# EasyEDA Pro project ProDoc_Mouth Board_2025-04-16.epro

# Schematic Mouth Board
Board Name: Mouth Board; Create Date: 2025-03-15; Page Name: P1; Project Name: Robotic Head α2; Schematic Name: Mouth Board; Update Date: 2025-03-17; Company: EasyEDA.com; Page Size: A4; Version: V1.0
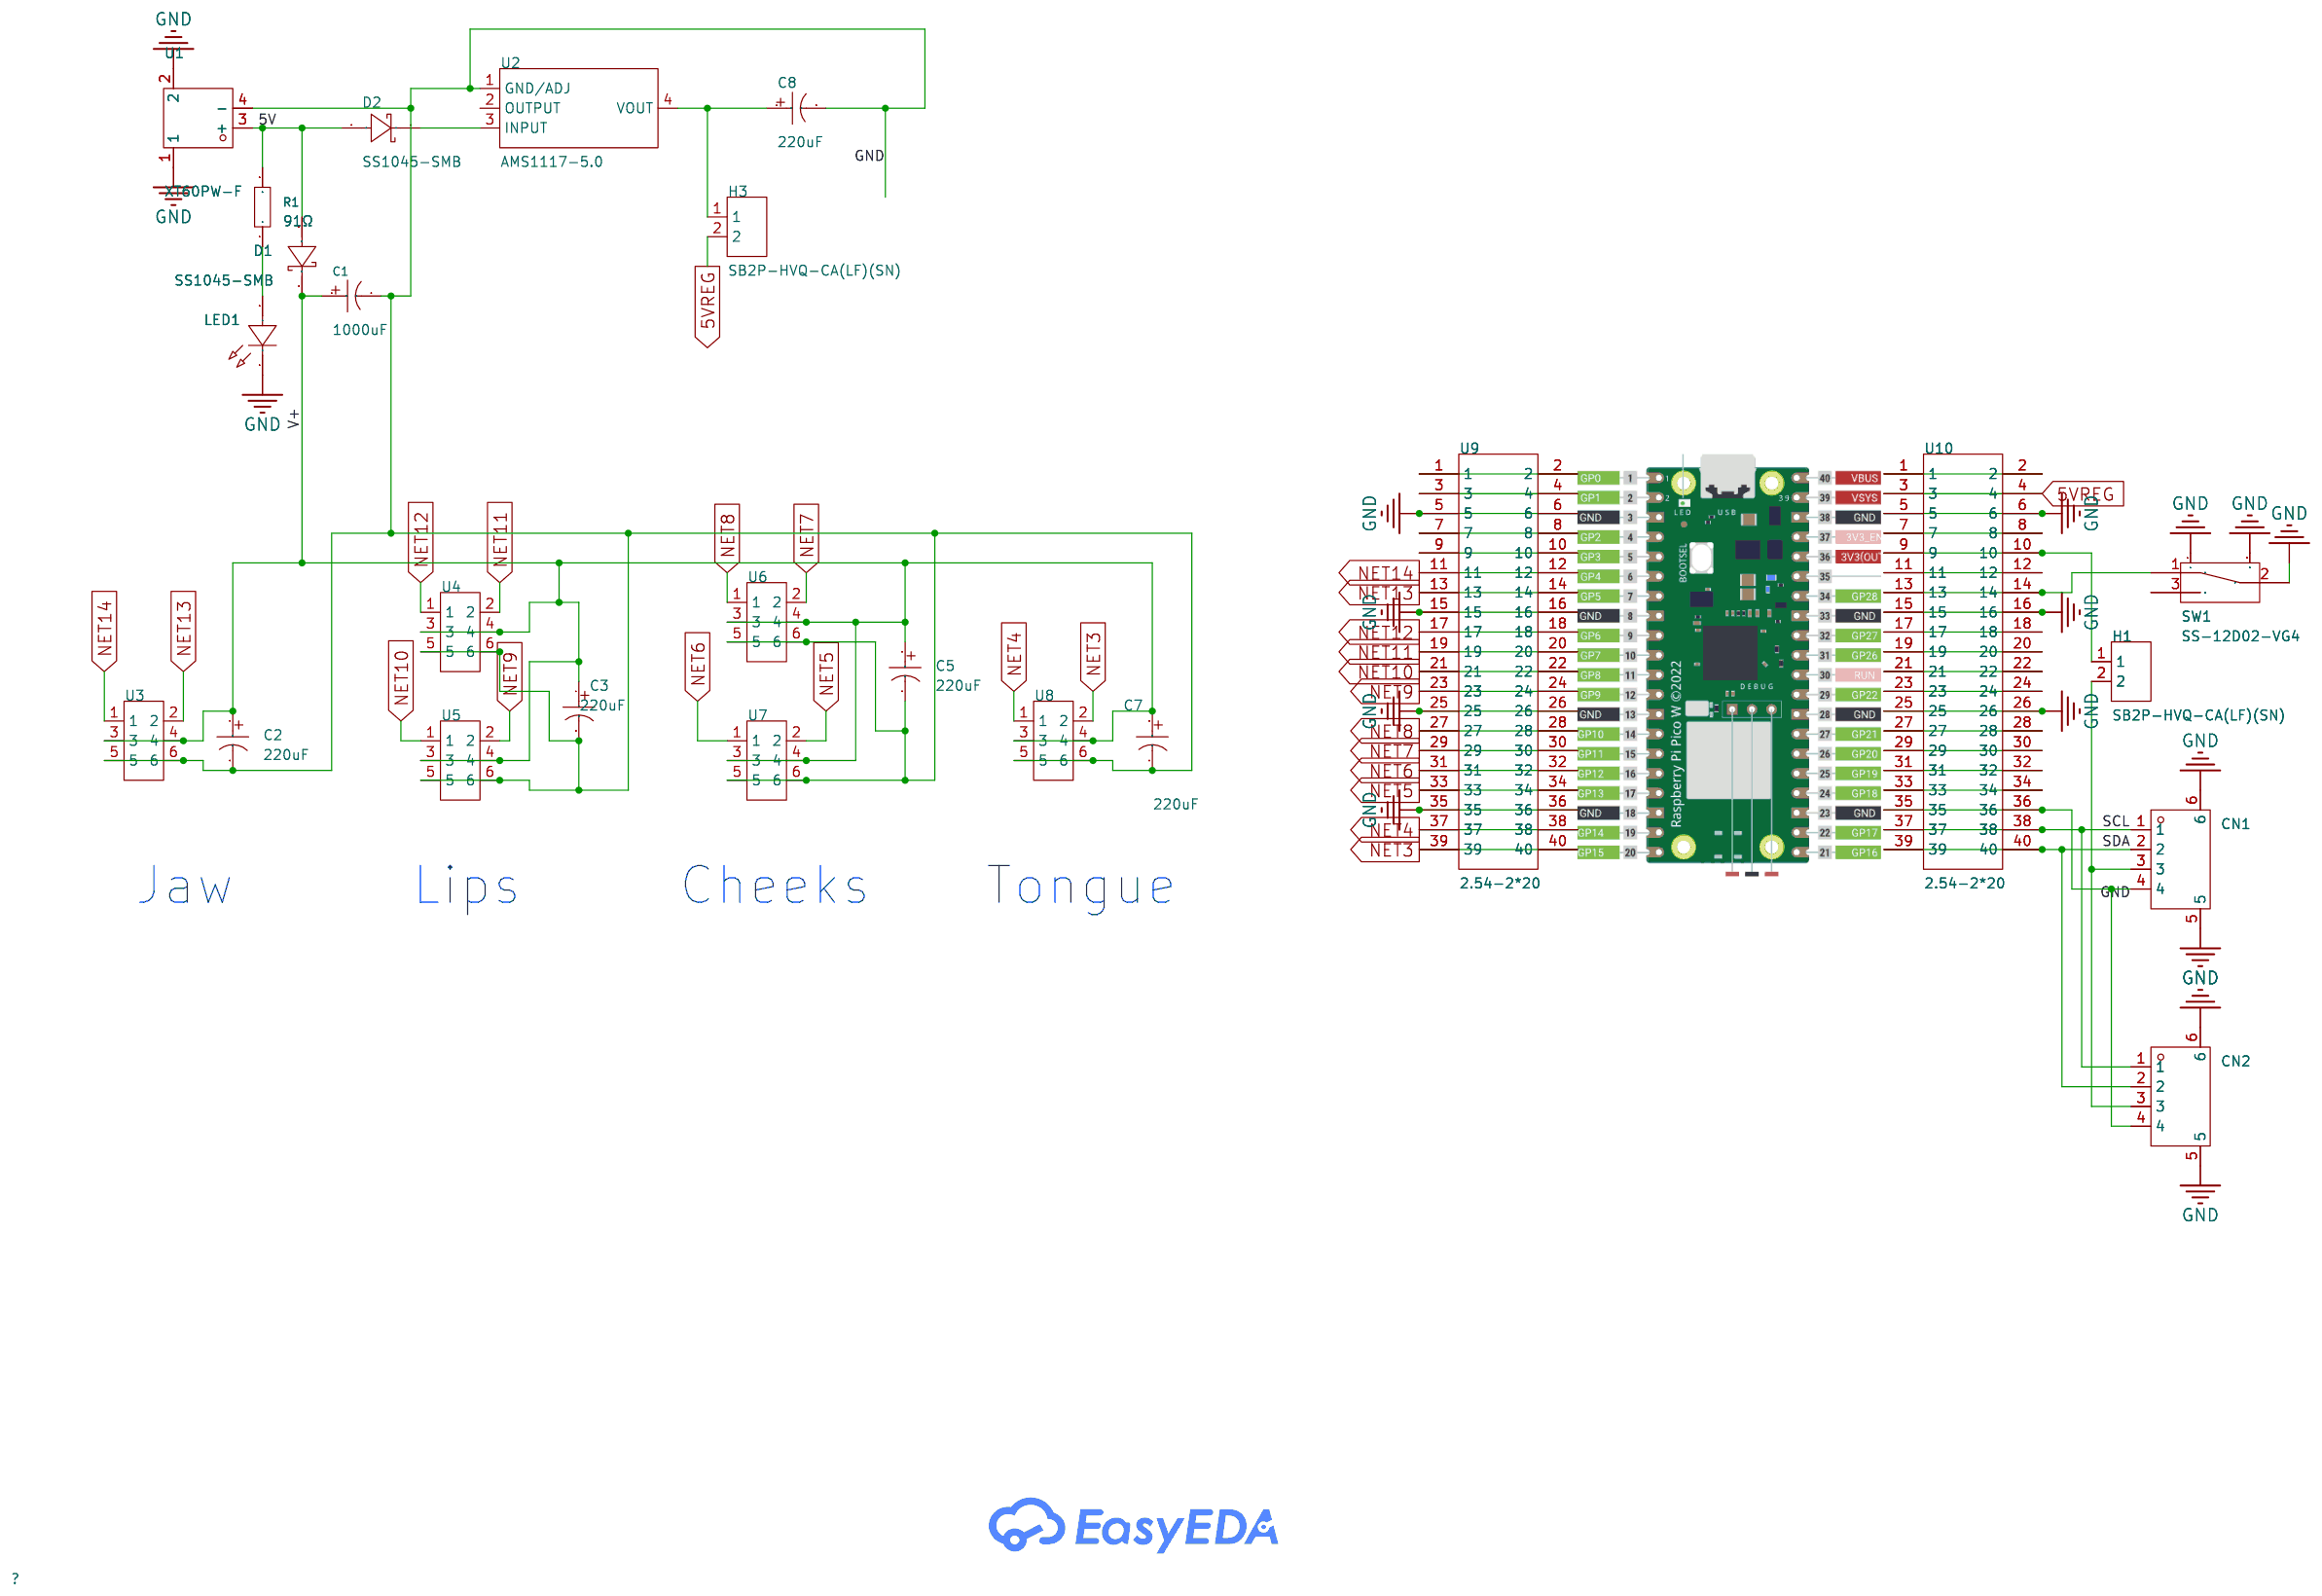
[diagram p0: schematic sheet]

## Parts
C1  1000uF  [CAP-SMD_BD10.0-L10.3-W10.3-FD]
C2  220uF  [CAP-SMD_BD6.3-L6.6-W6.6-FD]
C3  220uF  [CAP-SMD_BD6.3-L6.6-W6.6-FD]
C5  220uF  [CAP-SMD_BD6.3-L6.6-W6.6-FD]
C7  220uF  [CAP-SMD_BD6.3-L6.6-W6.6-FD]
C8  220uF  [CAP-SMD_BD6.3-L6.6-W6.6-FD]
CN1  HC-1.0-4PWT  [CONN-SMD_4P-P1.00_HCTL_HC-1.0-4PWT]
CN2  HC-1.0-4PWT  [CONN-SMD_4P-P1.00_HCTL_HC-1.0-4PWT]
D1  SS1045-SMB  [SMB_L4.4-W3.6-LS5.3-RD]
D2  SS1045-SMB  [SMB_L4.4-W3.6-LS5.3-RD]
H1  SB2P-HVQ-CA(LF)(SN)  [HDR-TH_2P-P2.54-V-M-1]
H3  SB2P-HVQ-CA(LF)(SN)  [HDR-TH_2P-P2.54-V-M-1]
LED1  XL-1608UBC-04  [LED0603-RD_BLUE]
R1  91Ω  [R1206]
SW1  SS-12D02-VG4  [SW-TH_SS-12D02-VG4]
U1  XT60PW-F  [TH_2P-XT60PW-F]
U2  AMS1117-5.0  [SOT-223-3_L6.5-W3.4-P2.30-LS7.0-BR]
U3  ZX-PZ2.54-2-3PZZ  [HDR-TH_6P-P2.54-V-M-R2-C3-S2.54-1]
U4  ZX-PZ2.54-2-3PZZ  [HDR-TH_6P-P2.54-V-M-R2-C3-S2.54-1]
U5  ZX-PZ2.54-2-3PZZ  [HDR-TH_6P-P2.54-V-M-R2-C3-S2.54-1]
U6  ZX-PZ2.54-2-3PZZ  [HDR-TH_6P-P2.54-V-M-R2-C3-S2.54-1]
U7  ZX-PZ2.54-2-3PZZ  [HDR-TH_6P-P2.54-V-M-R2-C3-S2.54-1]
U8  ZX-PZ2.54-2-3PZZ  [HDR-TH_6P-P2.54-V-M-R2-C3-S2.54-1]
U9  2.54-2*20  [HDR-TH_40P-P2.54-V-F-R2-C20-S2.54]
U10  2.54-2*20  [HDR-TH_40P-P2.54-V-F-R2-C20-S2.54]

## Library data of the parts
C1 = RVT1C102M1010: Capacitance: Tolerance:±20% Tolerance:±20% Rated Voltage: Ripple Current:- Equivalent Series Resistance(ESR):- φD: L: Lifetime @ Temp:2000hrs@105℃ Operating Temperature:-55℃~+105℃ Operating Temperature:-55℃~+105℃; LCSC Part Name: 1000uF ±20% 16V; Supplier Part: C3359; Manufacturer: HONOR(荣誉); Supplier Footprint: SMD,D10xL10.2mm; JLCPCB Part Class: Extended Part; Datasheet: https://atta.szlcsc.com/upload/public/pdf/source/20210521/C113284_25C86AE95FB541053FE695F13EA8E7D0.pdf; Supplier: LCSC; Tolerance: ±20%; Lifetime @ Temp: 2000hrs@105℃; Operating Temperature: -55℃~+105℃
C2 C3 C5 C7 C8 = RVT1A221M0605_C72494: Capacitance: Tolerance:±20% Tolerance:±20% Voltage Rating: Ripple Current: Equivalent Series Resistance(ESR):- Diameter: Height - Seated (Max): Lifetime:2000hrs@105℃ Operating Temperature:-40℃~+105℃ Operating Temperature:-40℃~+105℃; LCSC Part Name: 220uF ±20% 10V; Supplier Part: C72494; Manufacturer: ROQANG(容强); Manufacturer Part: RVT1A221M0605; Supplier Footprint: SMD,D6.3xL5.4mm; JLCPCB Part Class: Extended Part; Datasheet: https://atta.szlcsc.com/upload/public/pdf/source/20170325/1490427950282.pdf; Supplier: LCSC; Tolerance: ±20%; Lifetime: 2000hrs@105℃; Operating Temperature: -40℃~+105℃
CN1 CN2 = HC-1.0-4PWT: Pins Structure:1x4P Pitch:1mm Mounting Style:Horizontal attachment Reference Series:SH Number of Pins:4P Number of Rows:1 Number of PINs Per Row:4 Row Spacing:- Current Rating (Max):1A Contact Material:Phosphor Bronze Contact Plating:Tin Operating Tempera; LCSC Part Name: 1x4P 间距:1mm 卧贴 系列:SH; Supplier Part: C2845363; Manufacturer: HCTL(华灿天禄); Supplier Footprint: SMD,P=1mm,卧贴; JLCPCB Part Class: Extended Part; Datasheet: https://atta.szlcsc.com/upload/public/pdf/source/20230707/696F47DD5B3D5495B4AB8BCE302E8A84.pdf; Supplier: LCSC; Pins Structure: 1x4P; Pitch: 1mm; Mounting Style: Horizontal attachment; Reference Series: SH; Number of Pins: 4P; Number of Rows: 1; Number of PINs Per Row: 4; Current Rating (Max): 1A; Contact Material: Phosphor Bronze; Contact Plating: Tin; Operating Temperature Range: -25℃~+85℃; Rated Voltage (Max): 50V; Plastic Material: LCP; Flame Retardant Rating: UL94V-0; Supplementary Features: Auxiliary soldering legs; Z-Height of the Board: 3.2mm; X-Length of Bottom Edge on Board (Spacing Line): 6.3mm; Y-Width of Bottom Edge on Board: 5.05mm
D1 D2 = SS1045-SMB: Diode Configuration:Independent Type Voltage - Forward(Vf@If):550mV@10A Voltage - DC Reverse(Vr):45V Current - Rectified:10A Reverse Leakage Current (Ir):100nA; LCSC Part Name: 电压:45V 电流:10A; Supplier Part: C2903947; Manufacturer: GOODWORK(固得沃克); Supplier Footprint: SMB(DO-214AA); JLCPCB Part Class: Extended Part; Datasheet: https://atta.szlcsc.com/upload/public/pdf/source/20240617/4C132C80E36BDBE9AB2C039856844535.pdf; Supplier: LCSC; Diode Configuration: Independent Type; Voltage - Forward(Vf@If): 550mV@10A; Voltage - DC Reverse(Vr): 45V; Current - Rectified: 10A; Reverse Leakage Current (Ir): 100nA
H1 H3 = SB2P-HVQ-CA(LF)(SN): Pin Structure:1x2P Pitch:2.5mm Row Spacing:- Circluar Pins/Square Pins:- Mounting Type:Straight Number of Rows:Single Row Number of Pins:2P Current Rating:- Voltage Rating (Max):- Length of Mating Pin:7.5mm Insulation Height:3.3mm Length of End Connection; LCSC Part Name: 1x2P 间距:2.5mm 直插; Supplier Part: C157909; Manufacturer: JST; Supplier Footprint: 插件,P=2.5mm; JLCPCB Part Class: Extended Part; Datasheet: https://atta.szlcsc.com/upload/public/pdf/source/20180319/2518302FDF705D922213CC841EAA9FB0.pdf; Supplier: LCSC; Pin Structure: 1x2P; Pitch: 2.5mm; Mounting Type: Straight; Number of Rows: Single Row; Number of Pins: 2P; Length of Mating Pin: 7.5mm; Insulation Height: 3.3mm; Length of End Connection Pin: 3.4mm; Contact Material: Brass; Operating Temperature: -25℃~+85℃; Color: White
LED1 = XL-1608UBC-04: Lamp Holder Type:- Illumination Color:Blue Voltage - Forward(Vf):3.3V Voltage - Forward(Vf):3.3V Power(Watts):70mW Forward Current:20mA Wavelength - Dominant:455nm~475nm Wavelength - Dominant:455nm~475nm Peak Wavelength:470nm Diode Configuration:- Lens Co; Supplier Part: C965807; Manufacturer: XINGLIGHT(成兴光); Supplier Footprint: 0603; JLCPCB Part Class: Extended Part; Datasheet: https://atta.szlcsc.com/upload/public/pdf/source/20250213/9D28F40E58C3285D8CA3C7212E2FBA3B.pdf; Supplier: LCSC; Illumination Color: Blue; Voltage - Forward(Vf): 3.3V; Power(Watts): 70mW; Forward Current: 20mA; Wavelength - Dominant: 455nm~475nm; Peak Wavelength: 470nm; Lens Color: Colorless Transparent Lens; Luminous Intensity: 300mcd; Viewing Angle: 120°; Mounting Sytle: Positive Stick; Operating Temperature: -20℃~+85℃
R1 = 1206W4F910JT5E: Type:Thick Film Resistors Resistance:91Ω Tolerance:±1% Tolerance:±1% Power(Watts): Overload Voltage (Max): Temperature Coefficient:±100ppm/℃ Temperature Coefficient:±100ppm/℃ Operating Temperature Range:-55℃~+155℃ Operating Temperature Range:-55℃~+155℃; LCSC Part Name: 91Ω ±1% 250mW 厚膜电阻; Supplier Part: C25346; Manufacturer: UNI-ROYAL(厚声); Supplier Footprint: 1206; JLCPCB Part Class: Extended Part; Datasheet: https://atta.szlcsc.com/upload/public/pdf/source/20200306/C422600_1E6D84923E4A46A82E41ADD87F860B5C.pdf; Supplier: LCSC; Type: Thick Film Resistors; Tolerance: ±1%; Temperature Coefficient: ±100ppm/℃; Operating Temperature Range: -55℃~+155℃
SW1 = SS-12D02-VG4_C136719: Circuit:SPDT Actuator Style:Rectangular columnar Pin Style:PCPin Switch Height:8.7mm Mounting Style:Straight Current Rating (DC):- Voltage Rating (DC):- Current Rating (AC):- Voltage Rating (AC):- Mechanical Life:5千次 Operating Temperature:-25℃~+70℃ Operat; LCSC Part Name: 直插双档 滑动开关; Supplier Part: C136719; Manufacturer: 韩国韩荣; Supplier Footprint: 插件; JLCPCB Part Class: Extended Part; Datasheet: https://atta.szlcsc.com/upload/public/pdf/source/20171030/C136719_15093664985151068208.pdf; Supplier: LCSC; Circuit: SPDT; Actuator Style: Rectangular columnar; Pin Style: PCPin; Switch Height: 8.7mm; Mounting Style: Straight; Mechanical Life: 5千次; Operating Temperature: -25℃~+70℃
U1 = XT60PW-F: Power:- Output:- Input:- Size:- Interface:- Type:- Colour:Yellow MaximumCurrent:- Type:卧式插头 RatedVoltage:- Type1:- NumberOfUSBHoles:- InterfaceType:母头 MetalMaterial:- InsulationMaterial:- RatedCurrent:- RecommendedWireGauge:- FlameRetardantGrade:- contact; LCSC Part Name: AMASS(艾迈斯)插头连接器锂电池组充电接口 航模电调卧式焊板 母头 XT60PW-F; Supplier Part: C428722; Manufacturer: AMASS(艾迈斯); JLCPCB Part Class: Extended Part; Datasheet: https://atta.szlcsc.com/upload/public/pdf/source/20190916/C428722_DFF78979486FCB0B58C1FC563067EC88.pdf; Supplier: LCSC; Type: 卧式插头; Colour: Yellow; InterfaceType: 母头
U2 = AMS1117-5.0_C18212701: Output Type:Fixed Voltage - Supply:18V Output Voltage:5V Output Voltage:5V Output Current:1A Power Supply Rejection Ratio (PSRR):- Voltage Dropout:- standby current:- Noise:- Features:- Operating Temperature:- Operating Temperature:- Output Configuration:; Supplier Part: C18212701; Manufacturer: TECH PUBLIC(台舟); Supplier Footprint: SOT-223; JLCPCB Part Class: Extended Part; Datasheet: https://atta.szlcsc.com/upload/public/pdf/source/20231020/00568B8DF9DEE7CA65DA1D1C34EC001F.pdf; Supplier: LCSC; Output Type: Fixed; Voltage - Supply: 18V; Output Voltage: 5V; Output Current: 1A
U3-U8 = ZX-PZ2.54-2-3PZZ: Pin Structure:2x3P Pitch:2.54mm Row Spacing:2.54mm Circluar Pins/Square Pins:Policy Mounting Type:Straight Number of Rows:Double Row Number of Pins:6P Current Rating:3A Voltage Rating (Max):1kV Length of Mating Pin:6mm Insulation Height:2.5mm Length of En; LCSC Part Name: 2x3P 间距:2.54mm 方针 直插; Supplier Part: C7501274; Manufacturer: Megastar(兆星); Supplier Footprint: 插件,P=2.54mm; JLCPCB Part Class: Extended Part; Datasheet: https://atta.szlcsc.com/upload/public/pdf/source/20231122/E8390501A702A71E626C593F036B3607.pdf; Supplier: LCSC; Pin Structure: 2x3P; Pitch: 2.54mm; Row Spacing: 2.54mm; Circluar Pins/Square Pins: Policy; Mounting Type: Straight; Number of Rows: Double Row; Number of Pins: 6P; Current Rating: 3A; Voltage Rating (Max): 1kV; Length of Mating Pin: 6mm; Insulation Height: 2.5mm; Length of End Connection Pin: 3mm; Contact Material: Brass; Contact Plating: Gold; Operating Temperature: -40℃~+105℃; Color: Black
U9 U10 = 2.54-2*20: Holes Structure:2x20P Pitch:2.54mm Row Spacing:2.54mm Circular Hole / Square Hole:Square Holes Mounting Type:Straight Number of Rows:双排 Number of Holes:40P Current Rating (Max):2.5A Voltage Rating (Max):- Holes Direction:Top Insulation Height:8.5mm Operat; LCSC Part Name: 间距:2.54mm 2x20P 直插; Supplier Part: C2977589; Manufacturer: ZHOURI(洲日); Supplier Footprint: 插件,P=2.54mm; JLCPCB Part Class: Extended Part; Datasheet: https://atta.szlcsc.com/upload/public/pdf/source/20220328/834E302BE3C038BBC5C70F5E02589B1E.pdf; Supplier: LCSC; Holes Structure: 2x20P; Pitch: 2.54mm; Row Spacing: 2.54mm; Circular Hole / Square Hole: Square Holes; Mounting Type: Straight; Number of Rows: 双排; Number of Holes: 40P; Current Rating (Max): 2.5A; Holes Direction: Top; Insulation Height: 8.5mm; Operating Temperature Range: -40℃~+105℃

## Nets
5V: D1.2 D2.2 R1.2 U1.3(+)
5VREG: H3.2 U10.3 U10.4
GND: C1.2 C2.2 C3.2 C5.2 C7.2 C8.2 CN1.4 CN1.5 CN1.6 CN2.4 CN2.5 CN2.6 LED1.1(K) SW1.2 SW1.4 SW1.5 U1.1 U1.2 U1.4(-) U2.1(GND/ADJ) U3.5 U3.6 U4.5 U4.6 U5.5 U5.6 U6.5 U6.6 U7.5 U7.6 U8.5 U8.6 U9.5 U9.6 U9.15 U9.16 U9.25 U9.26 U9.35 U9.36 U10.5 U10.6 U10.15 U10.16 U10.25 U10.26 U10.35 U10.36
NET3: U8.2 U9.39 U9.40
NET4: U8.1 U9.37 U9.38
NET5: U7.2 U9.33 U9.34
NET6: U7.1 U9.31 U9.32
NET7: U6.2 U9.29 U9.30
NET8: U6.1 U9.27 U9.28
NET9: U5.2 U9.23 U9.24
NET10: U5.1 U9.21 U9.22
NET11: U4.2 U9.19 U9.20
NET12: U4.1 U9.17 U9.18
NET13: U3.2 U9.13 U9.14
NET14: U3.1 U9.11 U9.12
SCL: CN1.1 CN2.1 U10.37 U10.38
SDA: CN1.2 CN2.2 U10.39 U10.40
V+: C1.1 C2.1 C3.1 C5.1 C7.1 D1.1 U3.3 U3.4 U4.3 U4.4 U5.3 U5.4 U6.3 U6.4 U7.3 U7.4 U8.3 U8.4
$1N4017: D2.1 U2.3(INPUT)
$1N4091: U10.1 U10.2
$1N4100: U10.7 U10.8
$1N4115: U10.11 U10.12
$1N4130: U10.17 U10.18
$1N4135: U10.19 U10.20
$1N4140: U10.21 U10.22
$1N4145: U10.23 U10.24
$1N4155: U10.27 U10.28
$1N4160: U10.29 U10.30
$1N4165: U10.31 U10.32
$1N4170: U10.33 U10.34
$1N4286: U9.9 U9.10
$1N4291: U9.7 U9.8
$1N4323: U9.3 U9.4
$1N4327: U9.1 U9.2
$1N5155: CN1.3 CN2.3 H1.2
$1N5159: H1.1 U10.9 U10.10
$1N6464: SW1.1 U10.13 U10.14
$1N7592: LED1.2(A) R1.1
Net-(C8-1): C8.1 H3.1 U2.4(VOUT)

Not connected (* = marked no-connect by the designer): SW1 3; U2 2(OUTPUT)

## Notes on the sheet
- Jaw
- Lips
- Cheeks
- Tongue

# Board Mouth Board
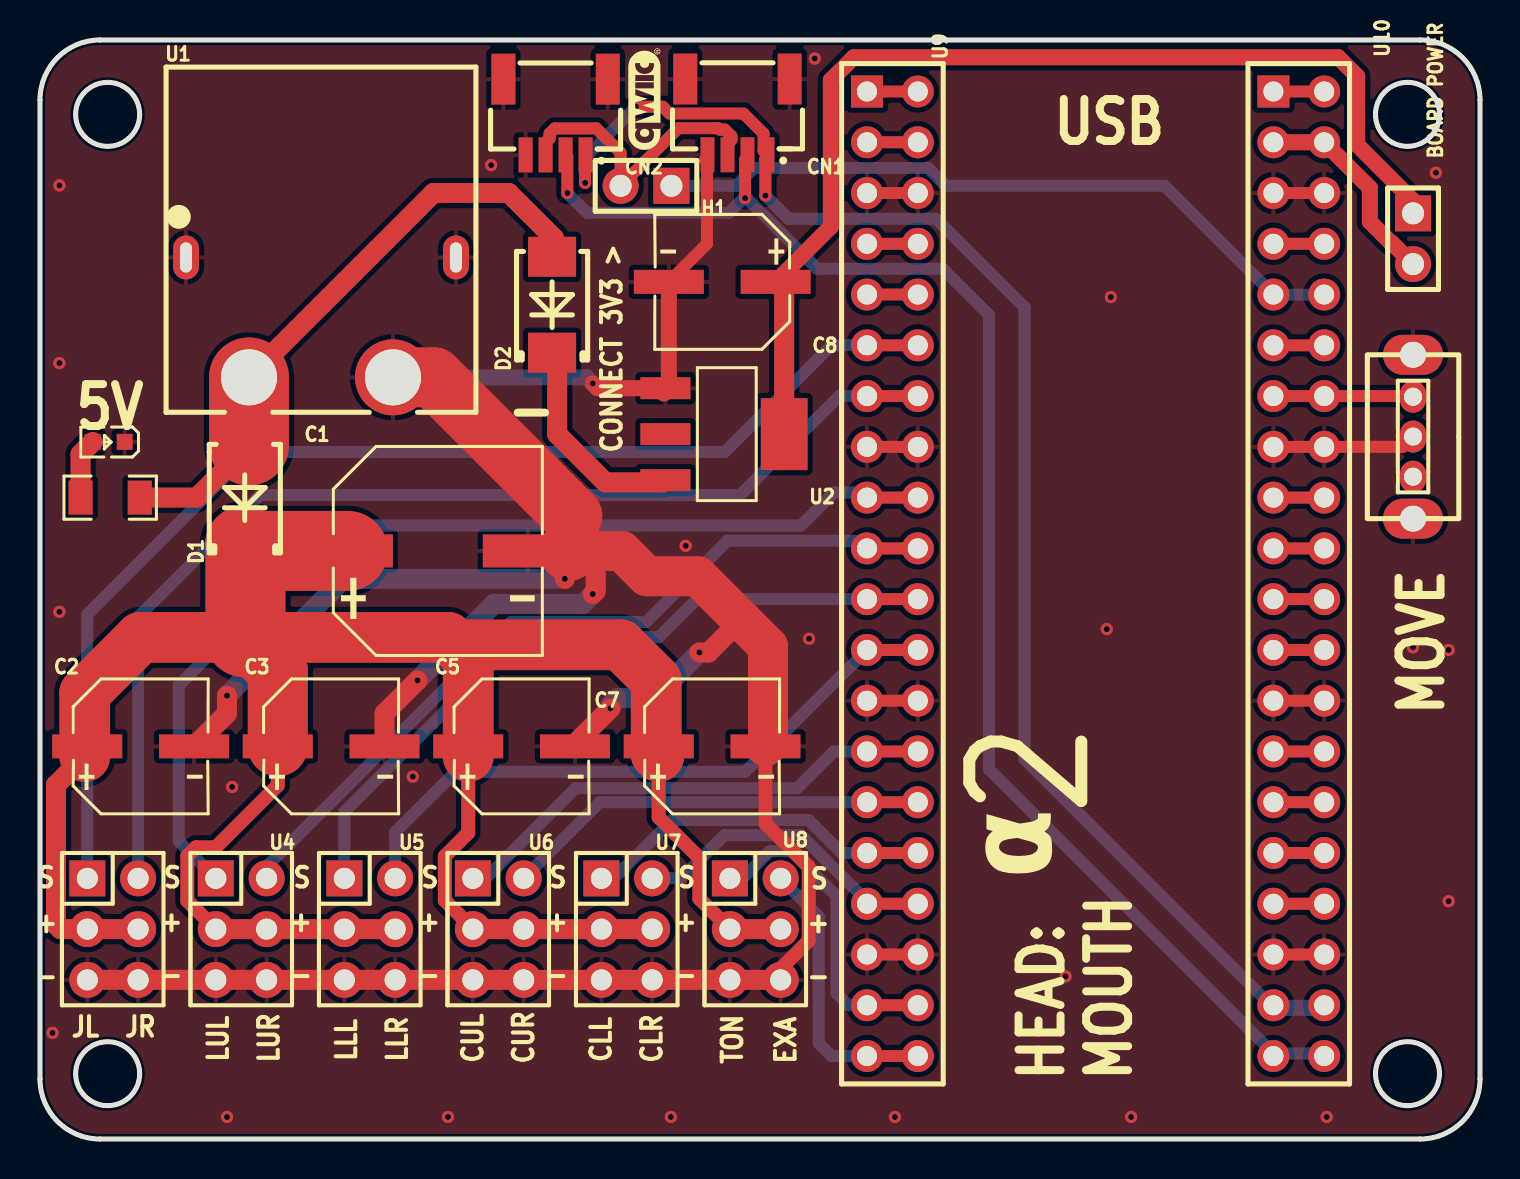
[diagram p1: board, top side]
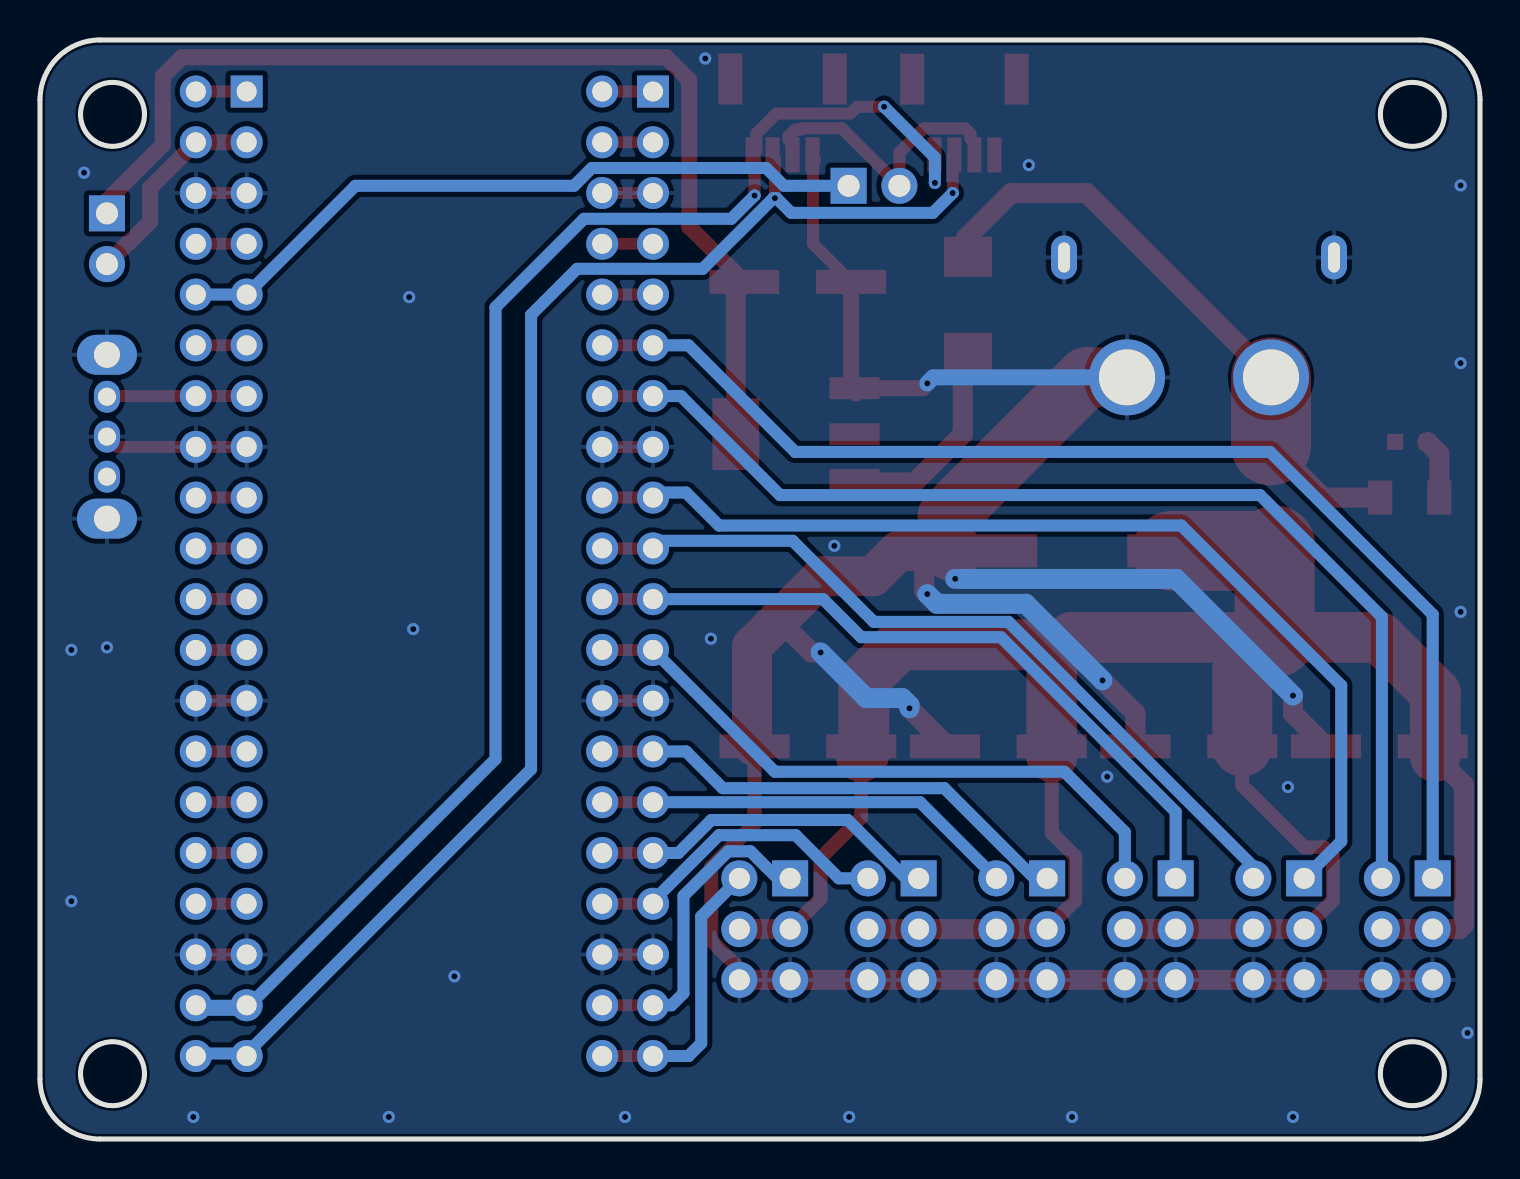
[diagram p2: board, bottom side, seen from below]

Outline 72.01 x 54.99 mm; copper layers: Top Layer, Bottom Layer. Coordinates in mm from the lower left corner of the outline.
Outline path: circle c3.38,51.27 r1.6 ; circle c3.38,3.27 r1.6 ; circle c68.38,51.27 r1.6 ; circle c68.38,3.27 r1.6 ; 0,51.99 0,3 arc(0.88,0.88) 3,0 69.01,0 arc(71.13,0.88) 72.01,3 72.01,51.99 arc(71.13,54.11) 69.01,54.99 3,54.99 arc(0.88,54.11) 0,51.99
Stack: Top Layer 0.035mm / Dielectric1 1.51mm FR4 er 4.5 / Bottom Layer 0.035mm

## Design rules (mm)
template: Custom Config
spacing copperThickness1oz (default): track to track 0.102, other pairs 0.152 to 0.3
spacing copperThickness2oz: track to track 0.203, other pairs 0.152 to 0.3
track width copperThickness1oz (default): min 0.127, default 0.254, max 10
track width copperThickness2oz: min 0.203, default 0.254, max 2.54
differential pair differentialPair (default): width min 0.127, default 0.254, max 2.54; gap min 0.152, default 0.152
via viaSize (default): diameter min 0.5, default 0.61, max 10; hole min 0.3, default 0.305, max 6.3

## Placement (name value [footprint] x y rotation side)
BOARD POWER  SB2P-HVQ-CA(LF)(SN)  [HDR-TH_2P-P2.54-V-M-1]  68.66 45.05 270 top
C1  1000uF  [CAP-SMD_BD10.0-L10.3-W10.3-FD]  19.89 29.43 0 top
C2  220uF  [CAP-SMD_BD6.3-L6.6-W6.6-FD]  5.03 19.65 0 top
C3  220uF  [CAP-SMD_BD6.3-L6.6-W6.6-FD]  14.56 19.65 0 top
C5  220uF  [CAP-SMD_BD6.3-L6.6-W6.6-FD]  24.08 19.65 0 top
C7  220uF  [CAP-SMD_BD6.3-L6.6-W6.6-FD]  33.61 19.65 0 top
C8  220uF  [CAP-SMD_BD6.3-L6.6-W6.6-FD]  34.12 42.89 180 top
CN1  HC-1.0-4PWT  [CONN-SMD_4P-P1.00_HCTL_HC-1.0-4PWT]  34.88 51.14 180 top
CN2  HC-1.0-4PWT  [CONN-SMD_4P-P1.00_HCTL_HC-1.0-4PWT]  25.78 51.13 180 top
D1  SS1045-SMB  [SMB_L4.4-W3.6-LS5.3-RD]  10.24 32.09 90 top
D2  SS1045-SMB  [SMB_L4.4-W3.6-LS5.3-RD]  25.61 41.74 90 top
H1  SB2P-HVQ-CA(LF)(SN)  [HDR-TH_2P-P2.54-V-M-1]  30.3 47.69 180 top
LED1  XL-1608UBC-04  [LED0603-RD_BLUE]  3.44 34.88 180 top
R1  91Ω  [R1206]  3.51 32.09 0 top
SW1  SS-12D02-VG4  [SW-TH_SS-12D02-VG4]  68.66 35.14 270 top
U1  XT60PW-F  [TH_2P-XT60PW-F]  14.05 41.11 0 top
U2  AMS1117-5.0  [SOT-223-3_L6.5-W3.4-P2.30-LS7.0-BR]  34.24 35.27 180 top
U3  ZX-PZ2.54-2-3PZZ  [HDR-TH_6P-P2.54-V-M-R2-C3-S2.54-1]  3.64 10.5 270 top
U4  ZX-PZ2.54-2-3PZZ  [HDR-TH_6P-P2.54-V-M-R2-C3-S2.54-1]  10.06 10.5 270 top
U5  ZX-PZ2.54-2-3PZZ  [HDR-TH_6P-P2.54-V-M-R2-C3-S2.54-1]  16.49 10.5 270 top
U6  ZX-PZ2.54-2-3PZZ  [HDR-TH_6P-P2.54-V-M-R2-C3-S2.54-1]  22.92 10.5 270 top
U7  ZX-PZ2.54-2-3PZZ  [HDR-TH_6P-P2.54-V-M-R2-C3-S2.54-1]  29.34 10.5 270 top
U8  ZX-PZ2.54-2-3PZZ  [HDR-TH_6P-P2.54-V-M-R2-C3-S2.54-1]  35.77 10.5 270 top
U9  2.54-2*20  [HDR-TH_40P-P2.54-V-F-R2-C20-S2.54]  42.63 28.28 270 top
U10  2.54-2*20  [HDR-TH_40P-P2.54-V-F-R2-C20-S2.54]  62.95 28.28 270 top

## Footprints (pads in the part's own frame, mm; a bottom-side part is the same pattern mirrored in y, then rotated)
CAP-SMD_BD6.3-L6.6-W6.6-FD
  rect 3.5x1.2 smd: 1(-2.67,0) 2(2.67,0)
CAP-SMD_BD10.0-L10.3-W10.3-FD
  rect 4.5x1.65 smd: 1(-4.5,0) 2(4.5,0)
CONN-SMD_4P-P1.00_HCTL_HC-1.0-4PWT
  rect 0.7x1.75 smd: 1(-1.5,1.895) 2(-0.5,1.895) 3(0.5,1.895) 4(1.5,1.895)
  rect 1.2x2.55 smd: 5(2.61,-1.895) 6(-2.61,-1.895)
HDR-TH_2P-P2.54-V-M-1
  rect 1.8x1.8 hole 1.1: 1(-1.27,0)
  round 1.8 hole 1.1: 2(1.27,0)
HDR-TH_6P-P2.54-V-M-R2-C3-S2.54-1
  rect 1.8x1.8 hole 1.05: 1(-2.54,-1.27)
  round 1.8 hole 1.05: 2(-2.54,1.27) 3(0,-1.27) 4(0,1.27) 5(2.54,-1.27) 6(2.54,1.27)
HDR-TH_40P-P2.54-V-F-R2-C20-S2.54
  rect 1.6x1.6 hole 1: 1(-24.13,-1.27)
  round 1.6 hole 1: 2(-24.13,1.27) 3(-21.59,-1.27) 4(-21.59,1.27) 5(-19.05,-1.27) 6(-19.05,1.27) 7(-16.51,-1.27) 8(-16.51,1.27) 9(-13.97,-1.27) 10(-13.97,1.27) 11(-11.43,-1.27) 12(-11.43,1.27) 13(-8.89,-1.27) 14(-8.89,1.27) 15(-6.35,-1.27) 16(-6.35,1.27) 17(-3.81,-1.27) 18(-3.81,1.27) 19(-1.27,-1.27) 20(-1.27,1.27) 21(1.27,-1.27) 22(1.27,1.27) 23(3.81,-1.27) 24(3.81,1.27) 25(6.35,-1.27) 26(6.35,1.27) 27(8.89,-1.27) 28(8.89,1.27) 29(11.43,-1.27) 30(11.43,1.27) 31(13.97,-1.27) 32(13.97,1.27) 33(16.51,-1.27) 34(16.51,1.27) 35(19.05,-1.27) 36(19.05,1.27) 37(21.59,-1.27) 38(21.59,1.27) 39(24.13,-1.27) 40(24.13,1.27)
LED0603-RD_BLUE
  rect 0.8x0.8 smd: 1(-0.799,-0.004) 2(0.799,0.004)
R1206
  rect 1.208x1.701 smd: 1(-1.479,0) 2(1.479,0)
SMB_L4.4-W3.6-LS5.3-RD
  rect 2x2.4 smd: 1(-2.4,0) 2(2.4,0)
SOT-223-3_L6.5-W3.4-P2.30-LS7.0-BR
  rect 2.5x1.1 smd: 1(2.97,-2.3) 2(2.97,0) 3(2.97,2.3)
  rect 2.34x3.6 smd: 4(-2.97,0)
SW-TH_SS-12D02-VG4
  oval 1.6x1.3 hole 0.9: 1(-2,0) 2(-0.006,0) 3(2,0)
  oval 2x3 hole 1.3: 4(4.1,0) 5(-4.1,0)
TH_2P-XT60PW-F
  oval 1.3x2.2 hole 0.6x1.5: 1(-6.75,3) 2(6.75,3)
  round 3.8 hole 2.8: 3(-3.6,-3) 4(3.6,-3)

## Nets
As in the schematic, except:
5VREG: BOARD POWER.2 U10.3 U10.4
$1N8629: BOARD POWER.1 C8.1 U2.4

Pads without a net: SW1 3; U2 2

## Via types
v1: diameter 0.61, hole 0.305, Top Layer to Bottom Layer, 35 vias

## Routing (per net, layer and track width the routed paths; a pad name or vN(x,y) marks a point on that pad's centre or on a via; arc(x,y) is an arc through that point)
5V: length 31.2
  Top Layer w1: U1.3 19.67,47.33 23.45,47.33 25.69,45.09 25.69,43.86 ; R1.2 7.84,32.09 D1.2
  Top Layer w2.54: 10.45,34.7 D1.2
  Top Layer w4: U1.3 10.45,34.7
5VREG: length 10.5
  Top Layer w0.8: U10.3 U10.4 66.5,47.59 66.5,45.9 67.53,44.86 67.57,44.86 BOARD POWER.2
GND: length 178.8
  Top Layer w0.6: SW1.2 68.15,34.63 U10.16 U10.15 ; U10.5 U10.6 ; 33.25,48.99 33.35,48.89 33.35,44.8 C8.2 ; U10.26 U10.25 ; U9.35 U9.36 ; U10.36 U10.35 ; U9.5 U9.6 ; U9.25 U9.26 ; U9.15 U9.16
  Top Layer w0.7: U8.6 37.04,8.52 38.44,9.92 38.44,13.62 36.28,15.78 36.28,19.14
  Top Layer w0.8: C8.2 31.45,37.55 31.2,37.3 ; U2.1 27.88,37.57 v1(27.64,37.81)
  Top Layer w1: 17.23,19.65 17.23,21.3 v1(18.88,22.95) ; 27.79,29.43 27.79,27.42 v1(27.64,27.27) ; C5.2 26.75,19.78 v1(28.53,21.55) ; 35.07,25.98 33.43,24.35 v1(32.97,24.35) ; v1(9.35,22.19) 9.35,21.29 C2.2 ; U3.5 U3.6 U4.5 U4.6 U5.5 U5.6 U6.5 U6.6 U7.5 U7.6 U8.5 U8.6 ; 26.24,28.88 v1(26.24,28.03)
  Top Layer w2: C7.2 36.4,19.77 36.4,24.65 32.9,28.16 30.35,28.16 29.08,29.43 26.78,29.43
  Top Layer w3: 26.62,31.17 19.68,38.11 U1.4 ; 26.62,29.62 26.43,29.43
  Bottom Layer w0.8: v1(27.64,37.81) 27.34,38.11 U1.4
  Bottom Layer w1: v1(32.97,24.35) 30.69,22.06 28.88,22.06 28.53,21.7 v1(28.53,21.55) ; v1(9.35,22.19) 15.19,28.03 v1(26.24,28.03) ; v1(18.88,22.95) 22.71,26.78 27.15,26.78 v1(27.64,27.27)
  vias: v1(0.63,5.31) v1(0.97,47.71) v1(0.97,38.82) v1(0.97,26.38) v1(9.35,1.1) v1(9.61,17.61) v1(18.64,18.13) v1(20.4,1.1) v1(22.56,48.73) v1(31.55,1.1) v1(32.29,29.68) v1(38.46,25.03) v1(38.74,54.06) v1(42.75,1.1) v1(51.29,8.14) v1(53.34,25.51) v1(53.55,42.13) v1(54.56,1.1) v1(64.34,1.1) v1(68.66,24.6) v1(69.8,48.35) v1(70.44,24.47) v1(70.44,11.9)
NET3: length 14.3
  Top Layer w0.6: U9.39 U9.40
  Bottom Layer w0.6: U9.39 39.58,4.15 38.94,4.79 38.94,11.14 U8.2
NET4: length 16
  Top Layer w0.6: U9.37 U9.38
  Bottom Layer w0.6: U8.1 35.13,13.04 36.48,14.39 37.6,14.39 39.83,12.16 39.83,7.29 40.43,6.69 U9.37
NET5: length 15.7
  Top Layer w0.6: U9.33 U9.34
  Bottom Layer w0.6: U7.2 32.06,13.04 34.22,15.2 38.05,15.2 41.36,11.9 U9.33
NET6: length 17.7
  Top Layer w0.6: U9.31 U9.32
  Bottom Layer w0.6: U9.31 40.09,14.31 38.44,15.96 31.62,15.96 28.7,13.04 U7.1
NET7: length 21.3
  Top Layer w0.6: U9.29 U9.30
  Bottom Layer w0.6: U9.29 28,16.85 U6.2
NET8: length 24.9
  Top Layer w0.6: U9.27 U9.28
  Bottom Layer w0.6: U9.27 39.71,19.39 37.87,17.55 26.79,17.55 22.27,13.04 U6.1
NET9: length 32.2
  Top Layer w0.6: U9.23 U9.24
  Bottom Layer w0.6: U5.2 17.76,15.35 20.78,18.38 35.26,18.38 U9.23
NET10: length 36.4
  Top Layer w0.6: U9.21 U9.22
  Bottom Layer w0.6: U5.1 15.22,16.37 23.96,25.11 30.94,25.11 32.85,27.01 U9.21
NET11: length 40.1
  Top Layer w0.6: U9.19 U9.20
  Bottom Layer w0.6: U9.19 40.97,29.93 34.37,29.93 30.31,25.88 23.58,25.88 11.33,13.63 U4.2
NET12: length 51.5
  Top Layer w0.6: U9.18 U9.17
  Bottom Layer w0.6: U4.1 6.94,14.9 6.94,22.69 14.94,30.7 38.05,30.7 39.71,32.35 41.1,32.35 U9.17
NET13: length 56.6
  Top Layer w0.6: U9.14 U9.13
  Bottom Layer w0.6: U9.13 39.96,37.17 35.01,32.22 11,32.22 4.91,26.12 U3.2
NET14: length 60.3
  Top Layer w0.6: U9.11 U9.12
  Bottom Layer w0.6: U3.1 2.37,26.25 10.5,34.38 34.24,34.38 39.58,39.71 U9.11
SCL: length 74.2
  Top Layer w0.6: CN1.1 36.18,49.45 36.18,50.31 35.18,51.31 31.48,51.31 31.14,51.65 v1(29.8,51.65) ; v1(27.26,47.84) 27.26,49.22 CN2.1 ; v1(36.28,47.21) 36.28,48.97 36.25,48.99
  Bottom Layer w0.6: 61.68,6.57 49.23,19.01 49.23,41.62 44.8,46.04 37.44,46.04 v1(36.28,47.21) ; v1(29.8,51.65) 27.26,49.11 v1(27.26,47.84)
  Bottom Layer w0.8: 64.22,6.57 61.68,6.57
SDA: length 73.5
  Top Layer w0.6: v1(35.26,47.08) 35.26,48.99 35.25,48.99 ; CN2.2 26.37,49.15 v1(26.37,47.33)
  Bottom Layer w0.6: v1(26.37,47.33) 27.36,46.34 34.45,46.34 35.18,47.08 v1(35.26,47.08) 35.33,47.08 38.87,43.54 45.15,43.54 47.45,41.24 47.45,18.5 61.68,4.28 64.22,4.28
V+: length 124.9
  Top Layer w0.7: C3.1 11.89,17.7 8.79,14.59 7.8,14.59 7.37,14.16 7.37,11.92 7.8,11.49 7.81,11.49 U4.3 ; U8.3 32.97,12.03 32.97,14.06 30.94,16.09 30.94,19.14 ; 21.41,19.14 21.41,15.32 20.24,14.15 20.24,11.93 21.41,10.76 21.41,10.73 U6.3
  Top Layer w1: U6.3 U6.4 U7.3 U7.4 ; U5.4 U5.3 U4.4 U4.3 ; U3.4 U3.3 1.03,10.5 0.8,10.73 0.8,17.72 2.22,19.14 2.24,19.14 ; U8.3 U8.4
  Top Layer w2.54: 2.24,19.14 2.24,22.31 5.03,25.1 20.41,25.1 21.41,24.09 21.41,19.14 ; 21.1,24.73 29.04,24.73 30.81,22.95 30.81,19.26 30.94,19.14
  Top Layer w3: 10.24,25.1 11.89,23.45 C3.1
  Top Layer w4: C1.1 10.51,29.43 10.27,29.66 ; D1.1 10.27,29.66 ; 10.27,29.66 10.27,25.13 10.24,25.1
$1N4017: length 10.6
  Top Layer w1: U2.3 31.16,32.85 28.28,32.85 25.86,35.27 25.86,39.09 D2.1
$1N4091: length 2.5
  Top Layer w0.6: U10.1 U10.2
$1N4100: length 2.5
  Top Layer w0.6: U10.8 U10.7
$1N4115: length 2.5
  Top Layer w0.6: U10.12 U10.11
$1N4130: length 2.5
  Top Layer w0.6: U10.18 U10.17
$1N4135: length 2.5
  Top Layer w0.6: U10.20 U10.19
$1N4140: length 2.5
  Top Layer w0.6: U10.22 U10.21
$1N4145: length 2.5
  Top Layer w0.6: U10.23 U10.24
$1N4155: length 2.5
  Top Layer w0.6: U10.28 U10.27
$1N4160: length 2.5
  Top Layer w0.6: U10.30 U10.29
$1N4165: length 2.5
  Top Layer w0.6: U10.32 U10.31
$1N4170: length 2.5
  Top Layer w0.6: U10.34 U10.33
$1N4286: length 2.5
  Top Layer w0.6: U9.9 U9.10
$1N4291: length 2.5
  Top Layer w0.6: U9.7 U9.8
$1N4323: length 2.5
  Top Layer w0.6: U9.3 U9.4
$1N4327: length 2.5
  Top Layer w0.6: U9.1 U9.2
$1N5155: length 14.9
  Top Layer w0.6: 34.41,49.22 34.41,49.82 34.58,49.99 34.58,50.17 34.24,50.51 33.98,50.51 33.92,50.58 31.92,50.58 H1.2 29.03,49.35 27.82,50.57 25.75,50.57 25.48,50.3 25.48,50.06 25.28,49.86 CN2.3
$1N5159: length 35.6
  Bottom Layer w0.6: H1.1 34.81,47.69 35.7,48.58 44.41,48.58 45.31,47.69 56.23,47.69 U10.9 U10.10
$1N6464: length 7
  Top Layer w0.6: U10.13 U10.14 68.63,37.17 SW1.1
$1N7592: length 3
  Top Layer w1: R1.1 2.03,34.27 LED1.2
$1N8629: length 55.1
  Top Layer w0.8: C8.1 39.55,45.65 39.55,52.98 40.69,54.13 64.92,54.13 65.87,53.17 65.87,49.75 68.66,46.95 BOARD POWER.1
  Top Layer w1: 37.21,34.38 37.21,42.46 C8.1

## Copper pours and planes (outline as drawn; the poured copper is in the pictures)
GND on Top Layer: -6.14,58.13 76.66,58.13 76.66,-6.13 -6.14,-6.13
GND on Bottom Layer: -2.71,58.76 75.14,58.76 75.14,-3.85 -2.71,-3.85

## Text on the board
Top Silkscreen Layer: JL | JR | LUL | LUR | LLL | LLR | CUL | CUR | CLL | CONNECT 3V3 > | CLR | TON | EXA | S | + | - | 5V | USB | HEAD: / MOUTH | MOVE | 2 | α
